# EAGLE design mixer (EAGLE 9.6.0)
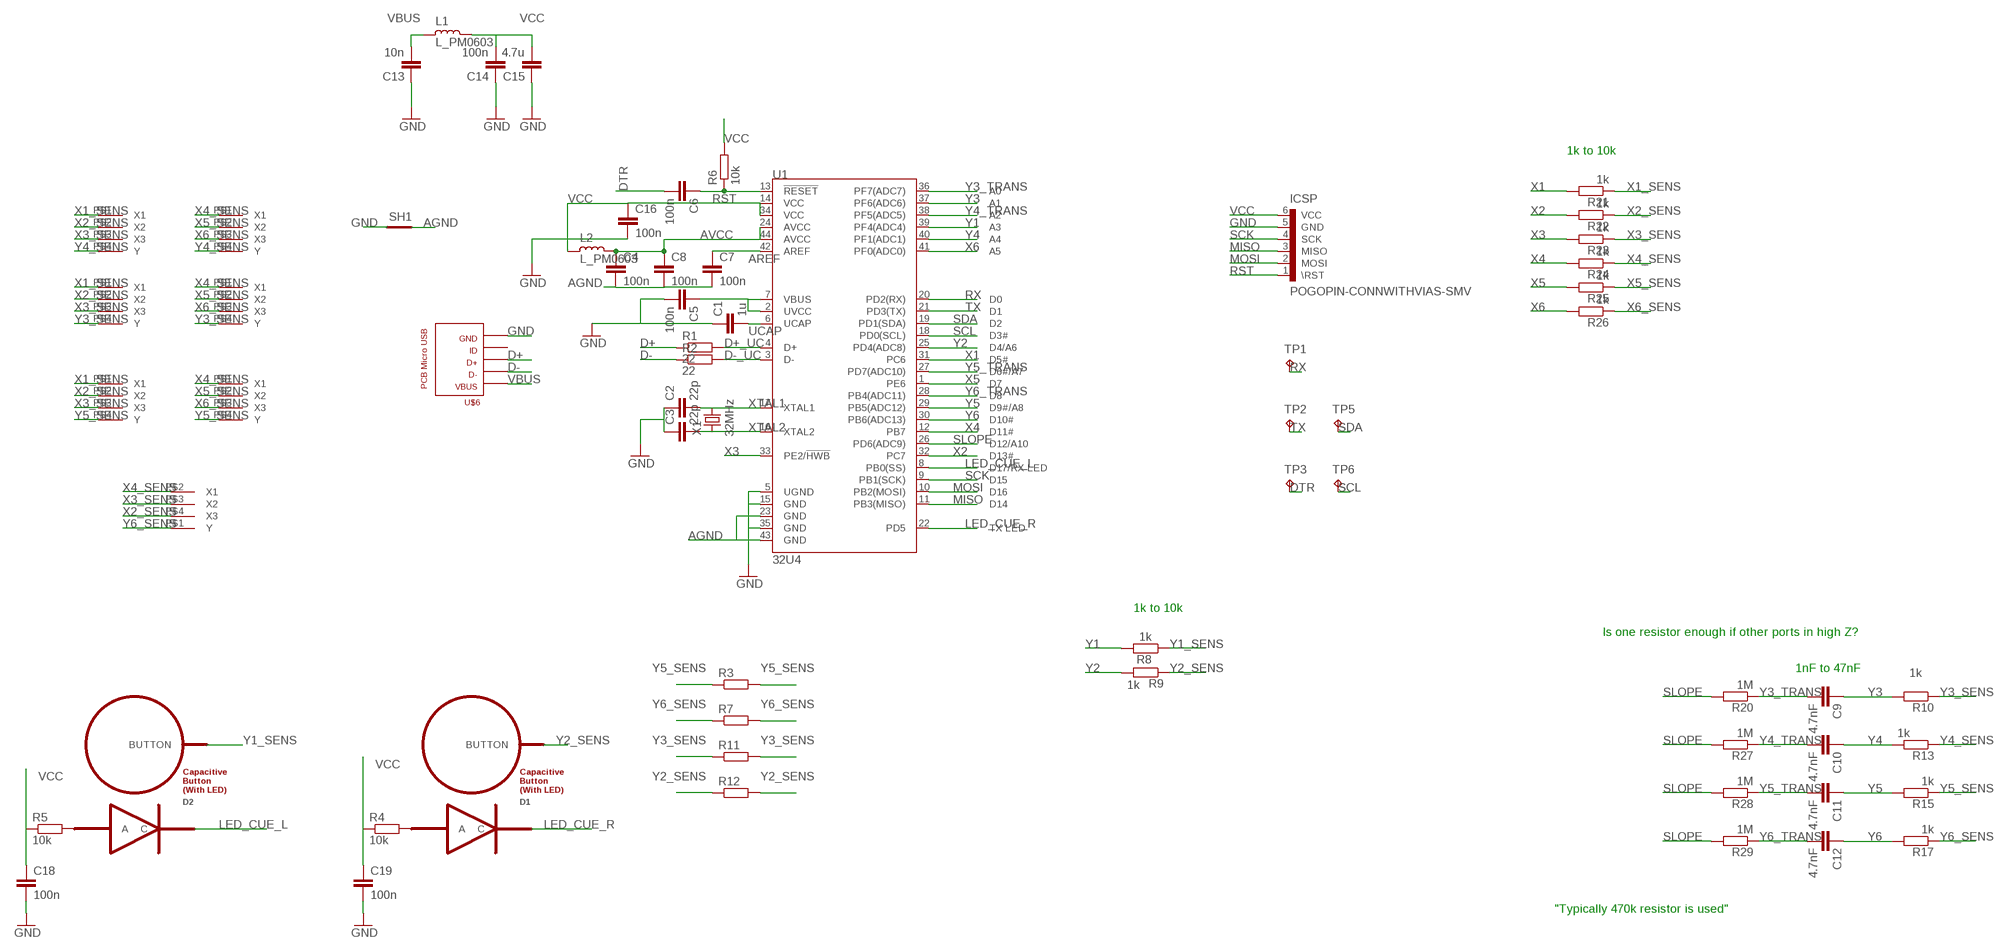
[diagram p0: schematic, sheet 1]

## Parts
C1  1u  C-EUC0402  [C0402]
C2  22p  C-EUC0402  [C0402]
C3  22p  C-EUC0402  [C0402]
C4  100n  C-EUC0402  [C0402]
C5  100n  C-EUC0402  [C0402]
C6  100n  C-EUC0402  [C0402]
C7  100n  C-EUC0402  [C0402]
C8  100n  C-EUC0402  [C0402]
C9  4.7nF  C-EUC0402  [C0402]
C10  4.7nF  C-EUC0402  [C0402]
C11  4.7nF  C-EUC0402  [C0402]
C12  4.7nF  C-EUC0402  [C0402]
C13  10n  C-EUC0402  [C0402]
C14  100n  C-EUC0402  [C0402]
C15  4.7u  C-EUC0402  [C0402]
C16  100n  C-EUC0402  [C0402]
C18  100n  C-EUC0402  [C0402]
C19  100n  C-EUC0402  [C0402]
D1  LED_BUTTON  [LED_BUTTON]
D2  LED_BUTTON  [LED_BUTTON]
ICSP  POGOPIN-CONNWITHVIAS-SMV  [POGOPROG-CONN-OH-SMALLERVIAS]
L1  L_PM0603  [PM0603]
L2  L_PM0603  [PM0603]
R1  22  R-EU_R0402  [R0402]
R2  22  R-EU_R0402  [R0402]
R3  R-EU_R0603  [R0603]
R4  10k  R-EU_R0402  [R0402]
R5  10k  R-EU_R0402  [R0402]
R6  10k  R-EU_R0402  [R0402]
R7  R-EU_R0603  [R0603]
R8  1k  R-EU_R0402  [R0402]
R9  1k  R-EU_R0402  [R0402]
R10  1k  R-EU_R0402  [R0402]
R11  R-EU_R0603  [R0603]
R12  R-EU_R0603  [R0603]
R13  1k  R-EU_R0402  [R0402]
R15  1k  R-EU_R0402  [R0402]
R17  1k  R-EU_R0402  [R0402]
R20  1M  R-EU_R0402  [R0402]
R21  1k  R-EU_R0402  [R0402]
R22  1k  R-EU_R0402  [R0402]
R23  1k  R-EU_R0402  [R0402]
R24  1k  R-EU_R0402  [R0402]
R25  1k  R-EU_R0402  [R0402]
R26  1k  R-EU_R0402  [R0402]
R27  1M  R-EU_R0402  [R0402]
R28  1M  R-EU_R0402  [R0402]
R29  1M  R-EU_R0402  [R0402]
SH1  SHORT  [SHORT_TOP-6]
TP1  TPTP06R  [TP06R]
TP2  TPTP06R  [TP06R]
TP3  TPTP06R  [TP06R]
TP5  TPTP06R  [TP06R]
TP6  TPTP06R  [TP06R]
U1  32U4  ATMEGA32U4QFN  [QFN-44]
U$1  EQ_MUTUAL  [SMALL_EQ]
U$2  EQ_MUTUAL  [SMALL_EQ]
U$3  EQ_MUTUAL  [SMALL_EQ]
U$4  EQ_MUTUAL  [SMALL_EQ]
U$5  EQ_MUTUAL  [SMALL_EQ]
U$6  PCB_MICRO_USB_BSS_2  [USB_TYPE_B_SS_2]
U$7  EQ_MUTUAL  [SMALL_EQ]
U$8  SLIDER  [SLIDER]
X1  32MHz  CRYSTAL-32MHZ-SMD-2.0X1.6MM  [CRYSTAL-SMD-2.0X1.6MM]

## Nets
AGND: C4.2 C7.2 C8.2 SH1.2 U1.23(GND) U1.43(GND)
AREF: C7.1 U1.42(AREF)
AVCC: C4.1 C8.1 L2.1 U1.24(AVCC) U1.44(AVCC)
D+: R1.1 U$6.3
D+_UC: R1.2 U1.4(D+)
D-: R2.1 U$6.2
D-_UC: R2.2 U1.3(D-)
DTR: C6.2 TP3.TP
GND: C1.1 C2.1 C3.1 C5.2 C13.1 C14.1 C15.1 C16.2 C18.2 C19.2 ICSP.5(GND) SH1.1 U1.5(UGND) U1.15(GND) U1.35(GND) U$6.5
LED_CUE_L: D2.C U1.8(PB0(SS))
LED_CUE_R: D1.C U1.22(PD5)
MISO: ICSP.3(MISO) U1.11(PB3(MISO))
MOSI: ICSP.2(MOSI) U1.10(PB2(MOSI))
N$9: D1.A R4.2
N$10: D2.A R5.2
RST: C6.1 ICSP.1(\RST) R6.1 U1.13(!RESET)
RX: TP1.TP U1.20(PD2(RX))
SCK: ICSP.4(SCK) U1.9(PB1(SCK))
SCL: TP6.TP U1.18(PD0(SCL))
SDA: TP5.TP U1.19(PD1(SDA))
SLOPE: R20.2 R27.2 R28.2 R29.2 U1.26(PD6(ADC9))
TX: TP2.TP U1.21(PD3(TX))
UCAP: C1.2 U1.6(UCAP)
VBUS: C13.2 L1.2 U$6.1
VCC: C5.1 C14.2 C15.2 C16.1 C18.1 C19.1 ICSP.6(VCC) L1.1 L2.2 R4.1 R5.1 R6.2 U1.2(UVCC) U1.7(VBUS) U1.14(VCC) U1.34(VCC)
X1: R21.2 U1.31(PC6)
X1_SENS: R21.1 U$1.P$1(X1) U$2.P$1(X1) U$3.P$1(X1)
X2: R22.2 U1.32(PC7)
X2_SENS: R22.1 U$1.P$2(X2) U$2.P$2(X2) U$3.P$2(X2) U$8.P$4(X3)
X3: R23.2 U1.33(PE2/!HWB)
X3_SENS: R23.1 U$1.P$3(X3) U$2.P$3(X3) U$3.P$3(X3) U$8.P$3(X2)
X4: R24.2 U1.12(PB7)
X4_SENS: R24.1 U$4.P$1(X1) U$5.P$1(X1) U$7.P$1(X1) U$8.P$2(X1)
X5: R25.2 U1.1(PE6)
X5_SENS: R25.1 U$4.P$2(X2) U$5.P$2(X2) U$7.P$2(X2)
X6: R26.2 U1.41(PF0(ADC0))
X6_SENS: R26.1 U$4.P$3(X3) U$5.P$3(X3) U$7.P$3(X3)
XTAL1: C2.2 U1.17(XTAL1) X1.3
XTAL2: C3.2 U1.16(XTAL2) X1.1
Y1: R8.2 U1.39(PF4(ADC4))
Y1_SENS: D2.BUTTON R8.1
Y2: R9.2 U1.25(PD4(ADC8))
Y2_SENS: D1.BUTTON R9.1 R12.1 R12.2
Y3: C9.1 R10.2 U1.37(PF6(ADC6))
Y3_SENS: R10.1 R11.1 R11.2 U$2.P$4(Y) U$5.P$4(Y)
Y3_TRANS: C9.2 R20.1 U1.36(PF7(ADC7))
Y4: C10.1 R13.2 U1.40(PF1(ADC1))
Y4_SENS: R13.1 U$1.P$4(Y) U$4.P$4(Y)
Y4_TRANS: C10.2 R27.1 U1.38(PF5(ADC5))
Y5: C11.1 R15.2 U1.29(PB5(ADC12))
Y5_SENS: R3.1 R3.2 R15.1 U$3.P$4(Y) U$7.P$4(Y)
Y5_TRANS: C11.2 R28.1 U1.27(PD7(ADC10))
Y6: C12.1 R17.2 U1.30(PB6(ADC13))
Y6_SENS: R7.1 R7.2 R17.1 U$8.P$1(Y)
Y6_TRANS: C12.2 R29.1 U1.28(PB4(ADC11))
Unconnected: U$6.4

## Notes on the sheet
- 1k to 10k
- 1k to 10k
- Is one resistor enough if other ports in high Z?
- 1nF to 47nF
- "Typically 470k resistor is used"

## Library data of the parts
C1-C16 C18 C19 = rcl:C-EU: CAPACITOR, European symbol; SPICEPREFIX: C
D1 D2 = credit_card_midi:LED_BUTTON
ICSP = Protofusion:POGOPIN-CONN: Protofusion custom pogo pin programming header
L1 L2 = rc-master-smd:L_: INDUCTOR
R1-R13 R15 R17 R20-R29 = rcl:R-EU_: RESISTOR, European symbol; SPICEPREFIX: R
SH1 = shorts:SHORT: Short between two nets
TP1-TP3 TP5 TP6 = testpad:TP: Test pad
U1 = SparkFun-IC-Microcontroller:ATMEGA32U4: Atmel MCU, 32KByte Atmel 44-pin 8-bit Microcontroller with 32KBytes of ISP Flash and USB Controller Datasheet <http://cdn.sparkfun.com/datasheets/Dev/Arduino/Boards/ATMega32U4.pdf> SparkFun Products LilyPad Arduino USB - ATmega32U4 Board <https://www.sparkfun.com/products/12049> (DEV-12049) Pro Micro - 5V/16MHz <https://www.sparkfun.com/products/12640> (DEV-12640) Pro Micro - 3.3V/8MHz <https://www.sparkfun.com/products/12587> (DEV-12587) Fio v3 - ATmega32U4 <https://www.sparkfun.com/products/11520> (DEV-11520) Qduino Mini <https://www.sparkfun.com/products/13614> (DEV-13614) Makey Makey - Standard Kit <https://www.sparkfun.com/products/11511> (WIG-11511) Makey Makey Deluxe Kit <https://www.sparkfun.com/products/11519> (WIG-11519); PROD_ID: IC-10828
U$1-U$5 U$7 = credit_card_midi:EQ_MUTUAL
U$6 = USB_pcb_connectors:PCB_MICRO_USB_B
U$8 = credit_card_midi:SLIDER
X1 = SparkFun-Clocks:CRYSTAL-32MHZ: 32MHz Crystal Digikey Example <http://www.digikey.com/product-detail/en/murata-electronics-north-america/XRCGB32M000F2P00R0/490-9769-1-ND/4952013> Frequency: 32MHz Frequency Stability: ±20ppm Frequency Tolerance: ±20ppm Load Capacitance: 6pF SparkFun Products SparkFun nRF52832 Breakout <https://www.sparkfun.com/products/13990>; PROD_ID: XTAL-13459

## Board
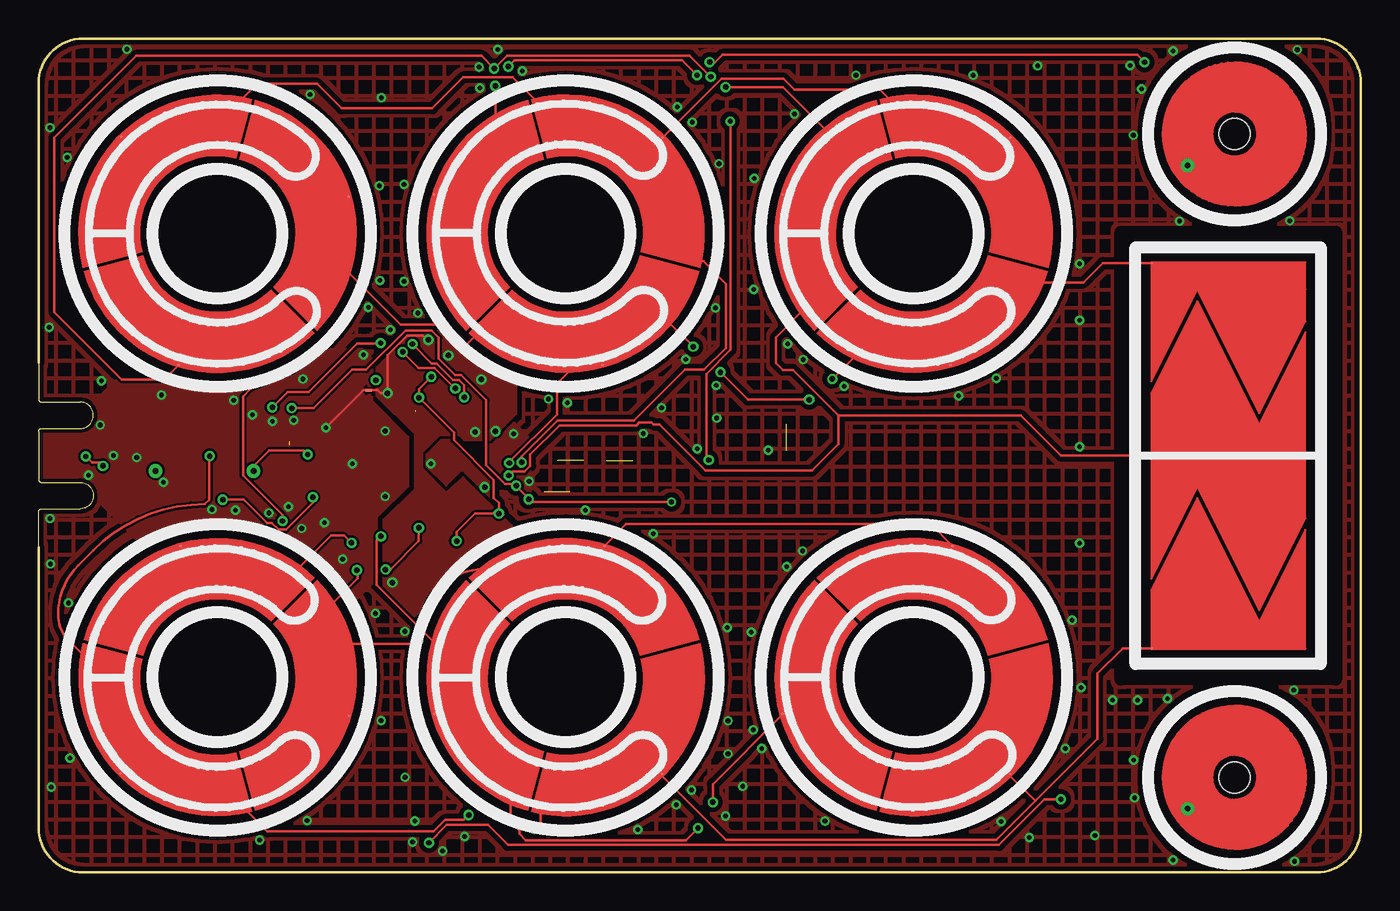
[diagram p1: board, top side]
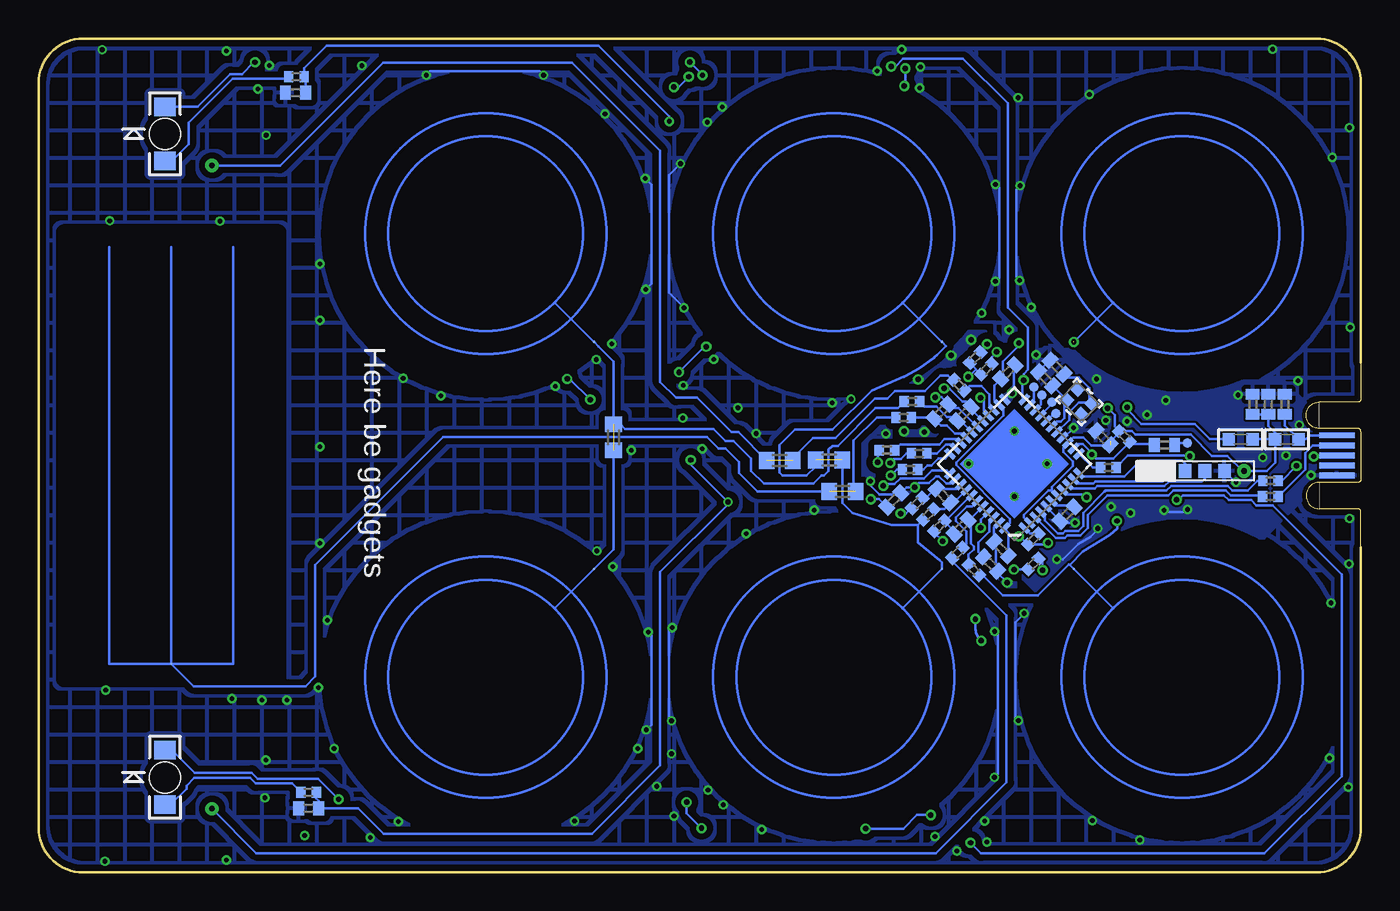
[diagram p2: board, bottom side, seen from below]

Size 85.6 x 53.98 mm. Coordinates in mm from the lower left corner, seen from the top.
Outline: 0,21.03 0,2.88 arc90 2.88,0 82.72,0 arc90 85.6,2.88 85.6,51.1 arc90 82.72,53.98 2.88,53.98 arc90 0,51.1 0,33.02
Copper layers (1*16): Top 0.035mm / dielectric 1.5mm / Bottom 0.035mm
Design rules "SeeedStudio_2layer_DRU_no_angle_20140221 *": minimum track width 6mil, minimum drill 0.3mm, track to track 6mil, track to pad 6mil, pad to pad 6mil, via to via 6mil, smd to smd 0mil, copper to edge 10mil, drill to drill 10mil, minimum pad ring 10mil, minimum via ring 6mil, stop-mask expansion 2mil, vias tented up to drill 100mil, thermal gap 10mil

### Footprints (pad centres in the part's own frame; a part is rotated, then mirrored left to right if it is on the bottom)
C0402 = smd 0.7 x 0.9: 1 -0.65,0; 2 0.65,0
LED_BUTTON = smd 1.2 x 1.4 bottom: A -1.754,0; C 1.754,0 | drill 0.356: BUTTON -2.032,3.048 | hole 2: 0,0
POGOPROG-CONN-OH-SMALLERVIAS = drill 0.381: 1 0,2.54; 6 0,-3.81 | smd 0.889 x 0.813: 2 0,1.27; 3 0,0; 4 0,-1.27; 5 0,-2.54
PM0603 = smd 0.8 x 0.8: 1 -0.762,0; 2 0.762,0
R0402 = smd 0.6 x 0.7: 1 -0.5,0; 2 0.5,0
R0603 = smd 1 x 1.1: 1 -0.85,0; 2 0.85,0
SHORT_TOP-6 = smd 0.305 x 0.152: 1 0.051,0; 2 -0.076,0
TP06R = smd 0.6 x 0.6: TP 0,0
QFN-44 = smd 0.8 x 0.3: 1 -3.4,2.5; 2 -3.4,2; 3 -3.4,1.5; 4 -3.4,1; 5 -3.4,0.5; 6 -3.4,0; 7 -3.4,-0.5; 8 -3.4,-1; 9 -3.4,-1.5; 10 -3.4,-2; 11 -3.4,-2.5; 23 3.4,-2.5; 24 3.4,-2; 25 3.4,-1.5; 26 3.4,-1; 27 3.4,-0.5; 28 3.4,0; 29 3.4,0.5; 30 3.4,1; 31 3.4,1.5; 32 3.4,2; 33 3.4,2.5 | smd 0.3 x 0.8: 12 -2.5,-3.4; 13 -2,-3.4; 14 -1.5,-3.4; 15 -1,-3.4; 16 -0.5,-3.4; 17 0,-3.4; 18 0.5,-3.4; 19 1,-3.4; 20 1.5,-3.4; 21 2,-3.4; 22 2.5,-3.4; 34 2.5,3.4; 35 2,3.4; 36 1.5,3.4; 37 1,3.4; 38 0.5,3.4; 39 0,3.4; 40 -0.5,3.4; 41 -1,3.4; 42 -1.5,3.4; 43 -2,3.4; 44 -2.5,3.4
SMALL_EQ = smd 0.152 x 0.152: P$1 -0.025,-8.839; P$2 -7.696,4.318; P$3 7.798,4.242 | smd 0.152 x 0.152 bottom: P$4 0,9.9
USB_TYPE_B_SS_2 = smd 0.37 x 2.3: 1 -1.3,-1.55; 2 -0.65,-1.55; 3 0,-1.55; 4 0.65,-1.55; 5 1.3,-1.55
SLIDER = smd 0.152 x 0.152 bottom: P$1 -0.991,-5.994 | smd 0.152 x 0.152: P$2 0.025,-1.041; P$3 12.497,-1.041; P$4 24.968,-1.041
CRYSTAL-SMD-2.0X1.6MM = smd 0.75 x 0.7: 1 -0.675,-0.5; 2 0.675,-0.5; 3 0.675,0.5; 4 -0.675,0.5

### Placement (x,y rotation side)
C1  19.01,23.2 45 bottom
C2  20.41,31.96 315 bottom
C3  19.67,32.7 315 bottom
C4  23.28,20.94 135 bottom
C5  16.68,28.14 135 bottom
C6  12.71,27.66 0 bottom
C7  23.98,19.96 315 bottom
C8  22.85,32.4 45 bottom
C9  27.03,24.38 135 bottom
C10  25.88,22.36 225 bottom
C11  25.68,29.68 45 bottom
C12  27.17,29.83 45 bottom
C13  4.93,30.3 270 bottom
C14  7.01,30.3 270 bottom
C15  5.98,30.3 270 bottom
C16  30.24,24.1 45 bottom
C18  68.97,50.47 180 bottom
C19  68.12,4.15 180 bottom
D1  77.42,47.8 90 top
D2  77.42,6.15 90 top
ICSP  11.37,25.99 90 bottom
L1  4.79,28.04 0 bottom
L2  7.79,28.04 0 bottom
R1  5.86,25.35 180 bottom
R2  5.86,24.33 180 bottom
R3  48.37,28.17 90 bottom
R4  68.91,51.51 180 bottom
R5  68.12,5.18 180 bottom
R6  15.3,28.22 135 bottom
R7  33.57,24.66 0 bottom
R8  26.11,20.69 45 bottom
R9  26.01,31.53 315 bottom
R10  28,23.16 45 bottom
R11  34.43,26.68 0 bottom
R12  37.62,26.67 0 bottom
R13  25.04,19.57 135 bottom
R15  29.06,30.48 0 bottom
R17  29.6,29.45 0 bottom
R20  28.73,23.9 225 bottom
R21  30.68,27.33 0 bottom
R22  28.6,27.13 0 bottom
R23  29.18,26.09 0 bottom
R24  16.34,26.2 180 bottom
R25  21.2,21.58 45 bottom
R26  21.21,19.96 225 bottom
R27  27.28,22.43 225 bottom
R28  24.24,32.59 225 bottom
R29  24.97,33.32 225 bottom
SH1  21.39,31.22 0 top
TP1  20.64,30.89 0 bottom
TP2  21.17,31.42 0 bottom
TP3  11.23,27.79 0 bottom
TP5  20.02,30.45 0 bottom
TP6  19.75,29.72 0 bottom
U1  22.42,26.45 135 bottom
U$1  11.58,41.35 225 top
U$2  34.12,41.35 135 top
U$3  56.65,41.35 135 top
U$4  11.58,12.63 315 top
U$5  34.12,12.63 45 top
U$6  0,26.99 270 bottom
U$7  56.65,12.63 45 top
U$8  71.02,14.48 90 top
X1  18.23,30.46 135 bottom

### Tracks (layer width: path | path; a pad name or v marks a point on that pad's centre or on a via)
AGND  (via drill 0.35)
  Top 0.152: SH1.2 21.95,31.22 22.14,31.02 v22.59,31.02 22.59,33.5 23.85,34.76 24.87,34.76 25.15,34.48 v25.23,34.48
  Bottom 0.152: U1.23 22.66,31.02 v22.59,31.02 22.48,31.14 22.48,32.77 C8.2 | U1.43 23.45,22.63 23.75,22.33 23.75,21.41 C4.2 23.64,21.3 23.64,20.03 23.52,19.91 C7.2 23.52,19.38 v22.9,18.76
  other vias: 28.25,28.51 29.57,28.56 28.66,31.91 26.53,33.46
  pour Top: 22.33,22.83 22.33,18.45 24.29,16.49 29.11,21.31 29.24,21.31 30.61,22.21 30.61,22.45 27.48,25.58 26.37,24.61 24.82,26.16 24.82,27.18 25.96,28.32 27.23,28.32 27.56,27.99 29.24,27.99 30.91,29.67 30.91,31.67 27.53,35.05 24.26,35.05 21.89,32.69 21.89,30.84 24.36,28.37 24.36,24.82 22.38,22.83
  pour Bottom (isolate 0.406): 22.33,22.83 22.33,18.45 24.29,16.49 29.11,21.31 29.24,21.31 30.61,22.21 30.61,22.45 27.48,25.58 26.59,24.8 25.32,26.06 25.32,27.69 25.96,28.32 27.23,28.32 27.56,27.99 29.24,27.99 30.91,29.67 30.91,31.67 27.53,35.05 24.28,35.05 21.51,32.28 21.51,31.22 23.7,29.03 23.7,24.16 22.38,22.83
AREF
  Bottom 0.152: U1.42 24.06,22.71 24.06,22.06 24.75,21.36 24.75,20.74 C7.1
AVCC  (via drill 0.35)
  Top 0.152: v22.14,34.27 22.12,34.24 20.62,34.24 17.47,31.09 16.11,31.09 v15.13,30.11
  Bottom 0.152: L2.1 9.77,28.04 10.76,29.02 14.2,29.02 15.13,29.95 v15.13,30.11 | v22.14,34.27 22.14,34.1 23.18,33.06 23.18,32.06 C8.1 23.74,31.51 23.74,30.59 U1.24 23.15,30.01 23.15,29.58 26.19,26.55 26.19,26.36 22.71,22.88 22.71,22.61 23.04,22.28 U1.44 23.06,22.22 22.82,21.98 C4.1
D+  (via drill 0.35)
  Top 0.152: v4.17,26.31 3.96,26.52 3.45,26.52 v3.05,26.92
  Bottom 0.152: R1.1 5.13,25.35 v4.17,26.31 | U$6.3 2.98,26.99 v3.05,26.92
D+_UC
  Bottom 0.152: U1.4 20.45,23.06 20.45,22.77 19.62,21.95 19.3,21.95 19.15,22.1 18.28,22.1 17.97,22.41 17.97,23.27 16.6,24.65 16.59,24.65 16.53,24.71 12.58,24.71 12.28,25.01 8.61,25.01 8.31,24.72 7.33,24.72 6.7,25.35 R1.2
D-
  Bottom 0.152: R2.1 3.61,26.08 3.61,27.15 3.12,27.64 U$6.2
D-_UC
  Bottom 0.152: U1.3 21.08,22.96 19.76,21.64 19.16,21.64 19.01,21.8 18.16,21.8 17.67,22.29 17.67,23.14 16.4,24.4 12.46,24.4 12.15,24.71 8.73,24.71 8.43,24.4 6.44,24.4 R2.2
DTR
  Bottom 0.152: TP3.TP 11.94,27.79 C6.2
GND  (via drill 0.3, 0.35)
  Top 0.152: v18.59,28.78 21.03,31.22 SH1.1
  Bottom 0.152: 18.57,28.8 v18.59,28.78 19.22,28.15 U1.15 | v60.5,51.61 60.25,51.87 53.16,51.87 v52.91,51.61 | U1.5 20.37,23.65 C1.1 19.36,22.63 v18.5,22.63 | C2.1 C3.1 | ICSP.5 v8.09,25.25 | U1.35 26.54,25.17 26.85,25.17 27.32,25.64 27.5,25.64 27.98,25.2 28.61,25.2 v28.88,24.93 29.41,24.93 C16.2 29.88,24.46 31.17,24.46 31.75,25.04 v31.75,25.32 | v23.7,15.6 23.5,15.39 23.5,6.38 v23.72,6.15 | v22.17,9.83 22.38,10.03 22.38,16.18 v21.79,16.76 | v46.25,9.22 45.92,9.55 45.92,15.34 v46.13,15.54 | v44.63,9.8 44.81,9.98 44.81,15.62 v44.58,15.85 | v44.04,45.88 44.81,45.12 44.81,37.54 v43.81,36.55 | v46.3,37.74 45.92,38.12 45.92,44.53 v46.33,44.93 | v23.66,38.27 23.41,38.52 23.41,44.28 v23.66,44.54 | v22.09,38.32 22.31,38.54 22.31,44.21 v22.06,44.46 | v19.68,20.27 19.28,20.27 18.3,21.25 17.5,21.72 17.03,22.19 v17.03,22.26 | v12.74,23.44 12.61,23.32 11.39,23.32 v11.21,23.5
  other vias: 21.02,33.5 2.03,7.39 1.93,17.44 0.77,19.96 0.81,5.51 17.39,3.35 35.39,23.44 39.8,21.92 49.45,20.8 48.44,19.79 46.81,8 45.59,5.56 44.63,7.67 42.27,5.33 62.31,3.28 41.27,4.37 38.8,2.77 27.57,2.31 66.47,8 67.49,11.96 69.52,11.15 71.15,11.15 73.08,11.25 81.25,11.79 68.38,2.39 70.94,4.83 70.89,7.26 73.43,0.79 81.31,0.71 24.55,36.21 48.93,49.11 71.4,50.72 70.87,47.73 73.86,42.16 81,42.19 81.48,53.26 73.43,53.19 67.39,39.4 67.39,35.74 62,31.98 59.56,30.86 52.15,31.47 49.5,33.2 48.49,34.21 40.32,30.09 34.23,30.4 41.9,33.21 67.39,21.31 66.9,16.33 67.39,27.56 28.51,52.15 41.35,49.56 28.56,50.79 17.58,50.37 1.85,46.28 0.74,48.21 0.69,35.28 4.06,31.83 44.46,3.64 5.71,53.29 42.32,48.56 20.31,26.45 22.43,28.57 25.4,26.44 0.74,22.91 3.23,25.7 7.95,30.9 3.99,28.96 33.01,30.65 14.9,23.27 21.34,36.58 43.89,29.41 43.88,31.52 47.23,27.32 42.63,27.43 24.21,1.97 24.35,3.31 14.31,2.08 22.43,24.33 26.15,1.37 64.14,2.26 64.67,52.22 50.9,3.33 12.62,30.57 13.84,29.63 16.17,23.67 30.75,28.38 39.15,28.41 31.31,51.88 29.73,53.28 22.19,50.15 22.77,35.12 6.35,26.86 4.85,26.99 15.14,29.2 16.51,29.27 17.12,31.94 70.66,52.25
  pour Top (isolate 0.305, rank 2, hatched): -3.23,56.69 -3.23,-2.36 88.04,-2.36 88.04,56.69
  pour Bottom (isolate 0.406, rank 2, hatched): -3.23,56.59 -3.23,-2.49 88.01,-2.49 88.01,56.59
  pour Top: 20.68,17.75 21.89,18.97 21.89,22.96 23.93,24.99 23.93,28.19 21.59,30.53 21.59,33.25 20.95,33.88 17.01,33.88 14.98,31.85 4.95,31.85 3.56,30.45 3.56,29.06 -0.03,29.06 -0.03,25.04 0,25.02 2.84,25.02 6.25,21.62 15.9,21.62 18.26,19.25 18.87,19.25 20.37,17.75
  pour Top: 25.12,26.29 26.38,25.03 27.42,26.07 30.77,22.72 31.85,23.8 31.85,28.04 30.81,29.08 30.76,29.08 29.36,27.69 27.41,27.69 27.1,27.99 26.06,27.99 25.12,27.05
  pour Bottom: 20.68,17.75 21.89,18.97 21.89,22.96 23.34,24.41 23.34,28.78 21.21,30.91 21.21,33.63 20.95,33.88 14,33.88 11.91,31.8 7.62,31.8 7.57,31.85 4.95,31.85 3.56,30.45 3.56,29.06 -0.03,29.06 -0.03,25.04 0,25.02 2.84,25.02 6.25,21.62 15.9,21.62 18.26,19.25 18.87,19.25 20.37,17.75
LED_CUE_L  (via drill 0.35)
  Top 0.152: v17.75,24.28 17.75,23.93 16.02,22.19 15.54,22.19 15.1,22.63 14.78,22.63 13.29,24.13 v11.92,24.13 | v25.27,1.91 26.43,3.06 29.1,3.06 30.38,1.78 62.18,1.78 65.12,4.72 v66.18,4.72
  Bottom 0.152: U1.8 19.02,24.46 17.93,24.46 v17.75,24.28 | v11.92,24.13 11.79,24.13 11.51,24.4 8.86,24.4 8.55,24.1 7.1,24.1 6.76,23.75 5.71,23.75 1.24,19.28 1.24,6.22 6.25,1.22 24.58,1.22 v25.27,1.91 | D2.C 76.94,7.9 75.49,6.45 71.81,6.45 71.41,6.06 67.51,6.06 v66.18,4.72
LED_CUE_R  (via drill 0.35)
  Top 0.152: v71.59,52.45 71.12,52.92 44.26,52.92 43.8,52.46 v43.43,52.46 | v42.62,51.61 41.66,52.58 30.81,52.58 v30.41,52.17
  Bottom 0.152: U1.22 21.93,30.76 21.93,31.77 v21.83,31.86 21.83,32.28 21.57,32.54 21.57,35.27 22.86,36.56 22.86,49.78 25.75,52.68 29.64,52.68 30.15,52.17 v30.41,52.17 | v43.43,52.46 42.62,51.65 v42.62,51.61 | v71.59,52.45 71.67,52.45 72.43,51.69 73.18,51.69 75.32,49.56 D1.C
MISO
  Bottom 0.152: U1.11 18.06,25.62 15.31,25.62 14.27,26.66 11.61,26.66 11.37,26.43 ICSP.3
MOSI
  Bottom 0.152: U1.10 18.33,25.19 17.31,25.19 17.19,25.32 12.84,25.32 12.64,25.51 ICSP.2
N$9
  Bottom 0.152: D1.A 76.99,46.05 75.9,47.14 75.9,48.53 73.05,51.38 69.54,51.38 R4.2
N$10
  Bottom 0.152: R5.2 69.19,5.75 71.54,5.75 71.89,6.11 75.53,6.11 76.02,5.61 76.02,5.41 77.04,4.39 D2.A
RST  (via drill 0.35)
  Top 0.152: ICSP.1 13.91,26.29 14.93,27.32 17.15,27.32 v17.41,27.05
  Bottom 0.152: U1.13 18.32,27.73 17.99,27.73 17.41,27.15 v17.41,27.05 17.16,26.8 16.02,26.8 R6.1 14.81,27.73 13.35,27.73 C6.1
RX
  Bottom 0.152: U1.20 20.71,30.28 20.71,30.81 TP1.TP
SCK
  Bottom 0.152: U1.9 18.69,24.84 17.23,24.84 17.06,25.01 12.71,25.01 12.4,25.32 10.28,25.32 10.1,25.5 ICSP.4
SCL
  Bottom 0.152: TP6.TP 19.87,29.72 U1.18
SDA
  Bottom 0.152: U1.19 20.63,29.66 20.63,29.72 20.02,30.33 TP5.TP
SLOPE  (via drill 0.35)  (1 unrouted)
  Top 0.152: v27.07,21.45 27.07,22.03 28.27,23.23 v29.79,23.23 29.79,23.9 29.45,24.25 29.45,25.41 26.89,27.97 26.89,28.47 v24.62,30.73 24.62,31.3 v25.41,32.08
  Bottom 0.152: R27.2 27.63,22.01 v27.07,21.45 | R20.2 29.12,23.55 29.44,23.23 v29.79,23.23 | 24.39,29.83 U1.26 | 24.41,29.86 24.41,30.52 v24.62,30.73 | v25.41,32.08 24.93,32.56 R28.2 R29.2
TX
  Bottom 0.152: U1.21 21.17,30.53 TP2.TP
UCAP
  Bottom 0.152: U1.6 19.74,23.77 18.72,23.77 C1.2
VBUS
  Bottom 0.152: U$6.1 3.33,28.28 3.57,28.04 L1.2 4.93,28.94 C13.2
VCC  (via drill 0.3, 0.35)  (1 unrouted)
  Top 0.152: v44.77,48.63 44.81,48.59 44.81,33.83 43.22,32.25 43.22,26.86 v43.38,26.7 | 40.87,23.88 v40.97,23.98 31.9,23.98 v31.73,24.16 v30.91,25.03 30.81,25.14 30.2,25.14 28.97,26.37 28.97,30.56 27.34,32.19 26.96,32.19 25.91,33.25 25.91,34.61 25.43,35.09 23.75,35.09 21.2,32.54 20.28,32.54 17.79,30.05 v16.39,30.05
  Bottom 0.152: U1.7 19.64,24.4 | v44.77,48.63 44.77,48.93 49.35,53.52 66.97,53.52 68.41,52.08 R4.1 68.32,51.41 C18.1 | U1.7 | U1.2 21.43,22.66 21.49,22.66 21.81,22.98 21.81,23.15 20.23,24.72 20,24.72 | C5.1 16.27,27.63 17.46,27.63 17.97,28.14 18.62,28.14 U1.14 19.27,27.48 19.27,27.22 18.66,26.61 18.66,26.3 20,24.96 20,24.72 | 16.22,27.88 15.66,28.45 R6.2 | R6.2 14.82,28.57 14.59,28.34 11.02,28.34 9.64,26.97 8.63,26.97 7.66,25.99 ICSP.6 6.1,25.99 5.55,26.54 L1.1 | C14.2 C15.2 5.98,28.88 5.55,28.45 L1.1 | U1.7 20,24.72 | v43.38,26.7 43.38,26.39 v40.97,23.98 40.97,23.83 45.36,19.43 45.36,6.91 49.78,2.49 63.26,2.49 64.93,4.15 C19.1 67.47,4.62 67.62,4.78 R5.1 | U1.34 26.8,26.02 27.78,26.02 28.29,25.51 29.82,25.51 30.2,25.13 30.81,25.13 v30.91,25.03 | 30.77,23.72 C16.1 31.21,24.16 v31.73,24.16 | L2.2 L1.1 | R6.2 15.94,28.85 15.94,29.59 v16.39,30.05
X1
  Bottom 0.152: R21.2 29.81,27.71 27.3,27.71 26.95,28.06 26.2,28.06 25.93,27.8 U1.31
X1_SENS  (via drill 0.35)
  Top 0.152: U$3.P$1 57.55,47.58 54.46,50.67 48.93,50.67 48.21,51.4 44.2,51.4 40.41,47.61 | 40.41,47.61 U$2.P$1 34.58,47.58 30.68,51.47 27.48,51.47 25.48,49.47 19.61,49.47 18.02,51.05 14.13,51.05 10.7,47.62 U$1.P$1 | v31.27,26.54 31.27,26.93 33.59,29.25 38.54,29.25 41.83,32.54 43.08,32.54 44.5,33.96 44.5,38.09 43.03,39.56 42.57,39.56 40.41,41.72 40.41,47.61
  Bottom 0.152: R21.1 31.27,27.24 v31.27,26.54
X2
  Bottom 0.152: R22.2 27.45,27.13 26.87,27.7 26.53,27.7 26.26,27.44 U1.32
X2_SENS  (via drill 0.35)
  Top 0.152: v30.46,26.5 30.46,26.55 33.55,29.64 33.55,31.65 34.42,32.52 | 34.42,32.52 34.76,32.85 36.28,32.85 | 36.28,32.85 U$2.P$2 | v51.38,31.94 53.16,33.72 58.18,33.72 U$3.P$2 59.04,33.35 64.4,38.71 64.92,38.19 67.63,38.19 68.89,39.45 U$8.P$4 | v49.89,30.61 45.92,30.61 v44.15,32.38 | v42.38,34.04 40.75,35.66 39.09,35.66 36.28,32.85 | U$1.P$2 20.08,38.83 23.43,35.47 25.82,35.47 27.19,34.1 27.64,34.1 28.43,34.9 32.04,34.9 34.42,32.52
  Bottom 0.152: v30.46,26.5 30.21,26.75 29.79,26.75 29.41,27.13 R22.1 | v51.38,31.94 51.22,31.94 v49.89,30.61 | v44.15,32.38 42.49,34.04 v42.38,34.04
X3
  Bottom 0.152: R23.2 28.31,26.09 28.05,26.35 27.79,26.35 27.35,26.79 26.89,26.79 U1.33
X3_SENS  (via drill 0.35)
  Top 0.152: U$1.P$3 8.13,31.9 5.38,31.9 1.02,36.27 1.02,47.57 6.31,52.87 28.66,52.87 v29.49,52.05 30.33,52.88 42.14,52.88 v43.51,51.51 | 51.78,29.57 63.59,29.57 66.18,26.98 U$8.P$3 | 51.78,29.57 48.82,32.52 48.18,32.52 47.73,32.98 47.73,34.62 49.37,36.26 49.37,42.64 U$3.P$3 51.66,47.38 48.2,50.84 v44.48,50.84 | U$2.P$3 27.5,41.97 27.5,44.36 29.59,46.46 29.59,50.88 v29.55,50.91 | v30.43,25.69 30.68,25.95 31.46,25.95 31.83,26.31 31.83,27.05 33.72,28.94 38.7,28.94 38.88,29.12 39.69,29.12 39.81,29 40.18,29 43.17,26.01 50.06,26.01 51.78,27.72 51.78,29.57
  Bottom 0.152: R23.1 30.04,26.09 v30.43,25.69 | v44.48,50.84 44.18,50.84 v43.51,51.51 | v29.55,50.91 29.49,50.98 v29.49,52.05
X4
  Bottom 0.152: R24.2 17.36,26.2 U1.12
X4_SENS  (via drill 0.35)
  Top 0.152: 64.52,4.62 68.54,8.64 68.54,12.87 70.18,14.5 U$8.P$2 | 64.52,4.62 62.89,6.25 U$7.P$1 | 64.52,4.62 62,2.1 44.51,2.1 40.35,6.25 U$5.P$1 34.86,6.36 32.5,4 32.5,3.25 v32.07,2.82 | v11.07,26.95 11.04,26.91 11.04,24.12 10.75,23.83 arc45 3.53,20.84 2.57,19.88 arc45 1.25,16.71 arc45 1.97,14.97 5.31,11.63 U$4.P$1 11.04,6.4 14.8,2.64 25.58,2.64 26.32,3.39 27.52,3.39 v27.84,3.71
  Bottom 0.152: R24.1 15.07,26.98 11.1,26.98 v11.07,26.95 | v32.07,2.82 29.63,2.82 28.74,3.71 v27.84,3.71
X5
  Bottom 0.152: R25.2 21.44,21.93 U1.1
X5_SENS  (via drill 0.35)
  Top 0.152: U$7.P$2 48.16,10.22 43.65,5.71 v43.65,4.53 | v22.15,21.75 21.89,21.49 21.89,18.59 25.62,14.86 U$5.P$2 30.57,5.3 30.57,3.25 31.13,2.69 31.13,2.49 31.53,2.08 41.91,2.08 v42.69,2.86 | U$4.P$2 10.52,19.8 16.92,19.8 18.92,21.81 19.79,21.81 v20.26,21.34
  Bottom 0.152: v22.15,21.75 22.08,21.75 R25.1 20.37,21.22 v20.26,21.34 | v43.65,4.53 43.65,3.82 v42.69,2.86
X6  (via drill 0.35)
  Top 0.152: v22.45,19.6 22.77,19.6 24.61,21.44 v24.61,22.3
  Bottom 0.152: U1.41 24.61,22.85 v24.61,22.3 | R26.2 21.57,19.6 v22.45,19.6
X6_SENS  (via drill 0.35)
  Top 0.152: U$7.P$3 57.76,22.55 38.04,22.55 U$5.P$3 35.1,19.61 28.77,19.61 arc45 25.95,18.44 25.7,18.2 arc45 v24.96,16.4 | v20.6,19.56 20.66,19.5 20.66,19.04 18.48,16.86 18.48,14.8 | U$4.P$3 18.48,11.73 18.48,14.8 | v24.57,14.99 24.38,14.8 18.48,14.8
  Bottom 0.152: v24.57,14.99 24.6,14.99 arc45 24.96,15.84 v24.96,16.4 | R26.1 20.63,20.09 20.63,19.59 v20.6,19.56
XTAL1
  Bottom 0.152: U1.17 19.69,29.19 19.44,29.19 19.2,29.42 19.2,30.45 X1.3 19.06,30.61 C2.2
XTAL2
  Bottom 0.152: U1.16 18.89,29.28 18.89,29.8 18.25,30.43 17.49,30.43 X1.1 17.59,30.53 17.59,31.37 18.25,32.04 19,32.04 C3.2
Y1
  Bottom 0.152: U1.39 25.18,23.69 25.52,23.69 26.22,22.99 26.22,22.74 25.55,22.07 25.55,21.25 R8.2
Y1_SENS
  Bottom 0.152: D2.BUTTON 71.51,1.25 27.51,1.25 22.94,5.82 22.94,16.64 26.46,20.17 R8.1
Y2
  Bottom 0.152: R9.2 25.36,31.48 24.58,31.48 24.05,30.95 24.05,30.2 U1.25
Y2_SENS  (1 unrouted)
  Bottom 0.152: R9.1 26.45,31.89 26.73,32.17 27.21,32.17 28.22,31.16 30.18,31.16 30.66,30.68 31.46,30.68 34.02,28.12 35.48,28.12 36.77,26.83 R12.2 | R12.1 40.3,28.5 40.74,28.5 42.98,30.73 44.35,30.73 45.36,31.75 45.36,46.71 51.08,52.43 63.3,52.43 69.98,45.74 74.38,45.74 D1.BUTTON
Y3
  Bottom 0.152: U1.37 26.37,23.92 C9.1 26.97,23.52 R10.2
Y3_SENS  (1 unrouted)
  Bottom 0.152: R11.2 33.56,26.66 33.56,23.91 32.91,23.26 30.39,22.48 28.66,22.48 | R11.1 35.28,26.29 35.88,25.69 37.44,25.69 37.62,25.87 37.62,27.67 36.64,28.66 34.2,28.66 31.66,31.2 29.59,32.09 29.58,32.08 29.54,32.11 29.48,32.13 29.48,32.14 28.62,32.63 28.61,32.63 28.56,32.66 28.52,32.69 28.51,32.7 27.71,33.27 27.7,33.27 27.66,33.31 27.61,33.34 27.61,33.35 27.45,33.49 27.43,33.49 26.85,34.08 U$2.P$4 | 28.66,22.48 28.66,21.35 27.25,20.19 27.12,20.06 U$5.P$4 | 28.66,22.48 R10.1
Y3_TRANS
  Bottom 0.152: U1.36 26.17,24.83 27.47,24.83 C9.2 27.54,24.84 28.12,24.25 R20.1
Y4
  Bottom 0.152: R13.2 25.4,20.59 25.07,20.91 25.07,21.11 25.24,21.28 25.24,22.65 C10.1 25.34,22.82 U1.40
Y4_SENS  (via drill 0.35)  (1 unrouted)
  Top 0.152: v15.79,22.75 15.79,23.14 13.23,25.69 13.23,30.81 13.74,31.32 16.48,32.46 v18.58,34.34
  Bottom 0.152: 18.86,19.91 18.89,19.94 20.91,17.92 23.16,17.92 24.46,19.22 R13.1 | 18.86,19.91 U$4.P$4 | U$4.P$4 | v15.79,22.75 15.76,22.72 15.76,22.27 16.26,21.84 17.98,20.78 18.86,19.91
Y4_TRANS
  Bottom 0.152: U1.38 25.26,24.4 26.88,22.78 R27.1 26.82,22.68 26.82,22.66 26.86,22.61 26.34,22.09 C10.2
Y5
  Bottom 0.152: R15.2 28.25,30.17 27.48,30.17 26.8,29.49 26.41,29.49 26.17,29.25 | 26.17,29.25 C11.1 | 26.17,29.25 25.93,29.25 U1.29
Y5_SENS  (1 unrouted)
  Bottom 0.152: R15.1 29.98,30.06 31.42,30.06 33.87,27.61 34.23,27.61 34.45,27.38 34.45,25.97 34.75,25.68 34.94,25.68 35.44,25.17 38.65,25.17 39.47,26 39.47,26.8 40.62,27.94 41.14,27.94 41.9,28.7 47.63,28.7 47.94,29.02 R3.2 48.37,33.07 49.36,34.06 | 49.36,34.06 | 49.36,34.06 U$3.P$4 | U$3.P$4 | R3.1 48.37,20.91 U$7.P$4 | U$7.P$4
Y5_TRANS  (via drill 0.35)
  Top 0.152: v26.98,31.33 26.96,31.33 25.64,32.65 24.61,32.65 v23.57,33.69
  Bottom 0.152: U1.27 25.22,29.95 C11.2 25.57,30.49 25.79,30.49 26.63,31.33 v26.98,31.33 | v23.57,33.69 23.89,33.37 R28.1
Y6
  Bottom 0.152: U1.30 25.81,28.42 26.29,28.42 26.81,28.94 27.19,28.94 C12.1 27.7,29.45 R17.2
Y6_SENS  (1 unrouted)
  Bottom 0.152: U$8.P$1 75.56,12.04 68.33,12.04 67.69,12.68 67.69,19.89 59.41,28.17 42.33,28.17 41.59,27.43 41.12,27.43 40.26,26.57 40.26,25.86 39.06,24.66 R7.1 | R17.1 31.34,29.45 32.84,27.95 32.84,24.79 R7.2
Y6_TRANS  (via drill 0.35)
  Top 0.152: v27.55,30.76 27.54,30.77 27.54,31.56 27.21,31.89 26.84,31.89 25.77,32.95 25.45,32.95 v24.21,34.2
  Bottom 0.152: U1.28 24.85,28.86 26.05,30.05 26.46,30.05 C12.2 27.17,30.76 v27.55,30.76 | R29.1 24.61,33.79 v24.21,34.2

### Text on the board
bPlace: Here be gadgets